# Altium schematic sheet Relay and connector.SchDoc
size A4; SheetNumber: 2; SheetTotal: 3
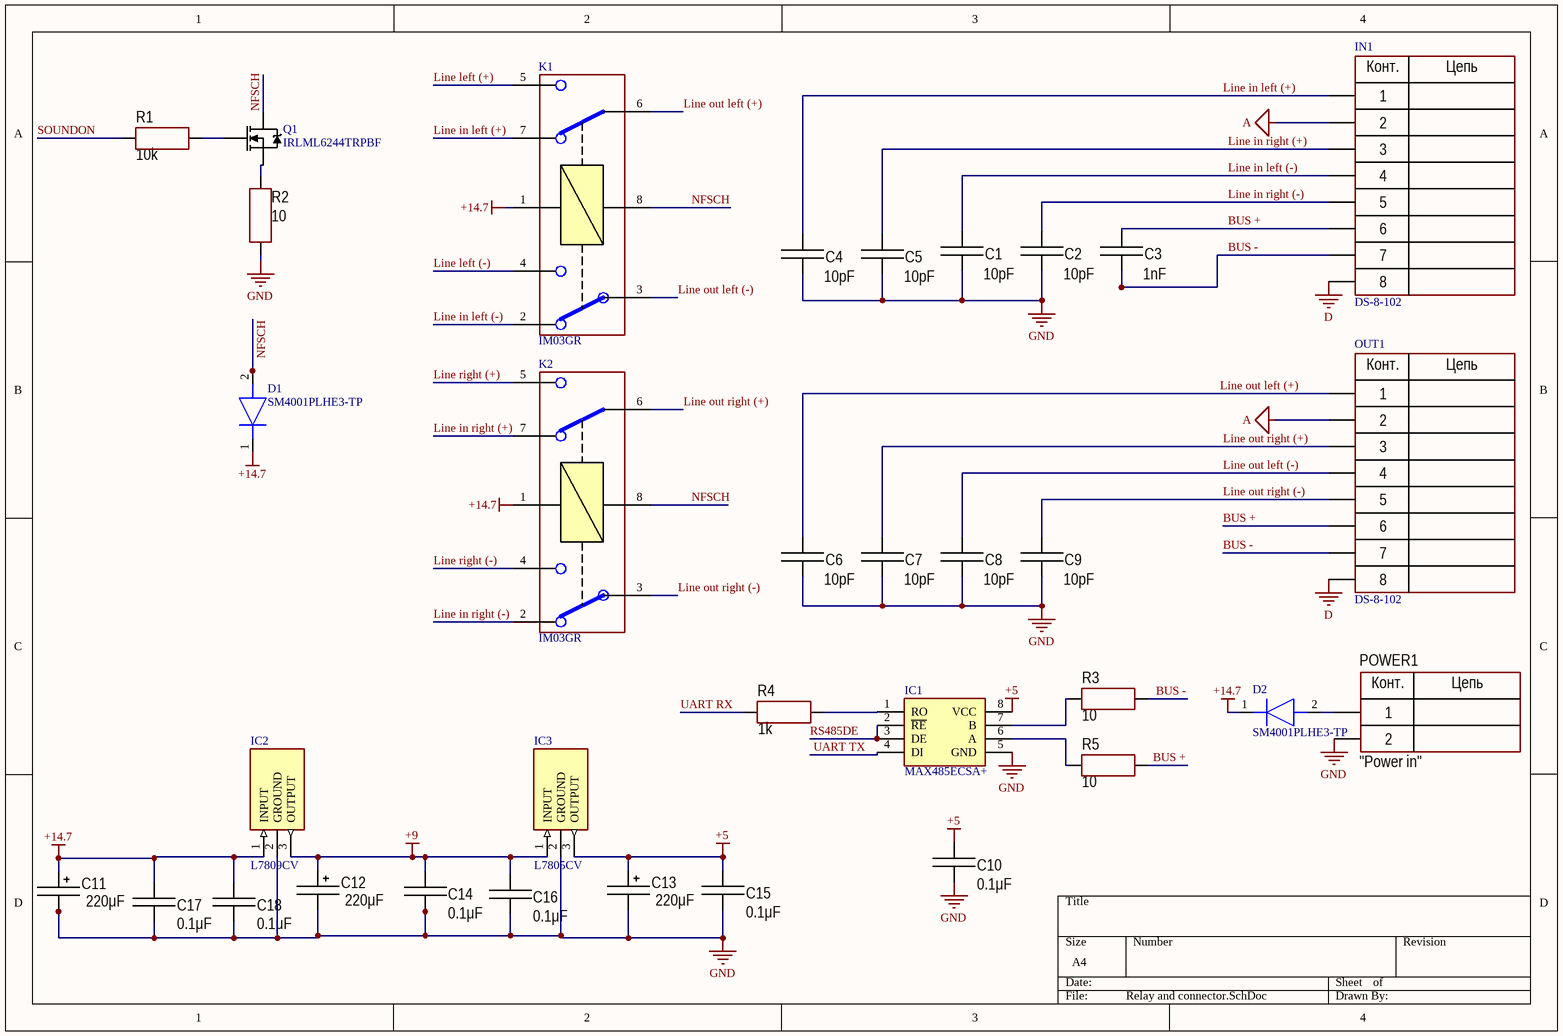
[diagram p0: Relay and connector.SchDoc]

## Parts
C1  value 10pF  [CAP: 0805]
C2  value 10pF  [CAP: 0805]
C3  value 1nF  [CAP: 0805]
C4  value 10pF  [CAP: 0805]
C5  value 10pF  [CAP: 0805]
C6  value 10pF  [CAP: 0805]
C7  value 10pF  [CAP: 0805]
C8  value 10pF  [CAP: 0805]
C9  value 10pF  [CAP: 0805]
C10  value 0.1μF  [CAP: 0805]
C11  value 220μF  [CAP: D10C5H20]
C12  value 220μF  [CAP: D10C5H20]
C13  value 220μF  [CAP: D10C5H20]
C14  value 0.1μF  [CAP: 0805]
C15  value 0.1μF  [CAP: 0805]
C16  value 0.1μF  [CAP: 0805]
C17  value 0.1μF  [CAP: 0805]
C18  value 0.1μF  [CAP: 0805]
D1  SM4001PLHE3-TP  [SODFL3616X135N]
D2  SM4001PLHE3-TP  [SODFL3616X135N]
IC1  MAX485ECSA+  [SOIC127P600X175-8N]
IC2  L7809CV  [TO255P460X1020X2008-3P]
IC3  L7805CV  [TO255P460X1020X2008-3P]
IN1  DS-8-102  [DS-8-102]
K1  IM03GR  [IM06GR]
K2  IM03GR  [IM06GR]
OUT1  DS-8-102  [DS-8-102]
POWER1  CommentText: "Power in"  [CON: CWF-2]
Q1  IRLML6244TRPBF  [SOT95P237X112-3N]
R1  value 10k  [RES: 0805]
R2  value 10  [RES: 0805]
R3  value 10  [RES: 0805]
R4  value 1k  [RES: 0805]
R5  value 10  [RES: 0805]

## Nets
+5: C10.1 C13.1 C15.1 IC1.8(VCC) IC3.3(OUTPUT)
+9: C12.1 C14.1 C16.1 IC2.3(OUTPUT) IC3.1(INPUT)
+14.7: C11.1 C17.1 C18.1 D1.1(K) D2.1(K) IC2.1(INPUT) K1.1 K2.1
A: IN1.2 OUT1.2
D: IN1.8 OUT1.8
GND: C1.1 C2.1 C4.1 C5.1 C6.1 C7.1 C8.1 C9.1 C10.2 C11.2 C12.2 C13.2 C14.2 C15.2 C16.2 C17.2 C18.2 IC1.5(GND) IC2.2(GROUND) IC3.2(GROUND) POWER1.2 R2.1
BUS +: C3.2 IN1.6 OUT1.6 R5.2
BUS -: C3.1 IN1.7 OUT1.7 R3.2
Line in left (+): C4.2 IN1.1 K1.7
Line in left (-): C1.2 IN1.4 K1.2
Line in right (+): C5.2 IN1.3 K2.7
Line in right (-): C2.2 IN1.5 K2.2
Line left (+): K1.5
Line left (-): K1.4
Line out left (+): C6.2 K1.6 OUT1.1
Line out left (-): C8.2 K1.3 OUT1.4
Line out right (+): C7.2 K2.6 OUT1.3
Line out right (-): C9.2 K2.3 OUT1.5
Line right (+): K2.5
Line right (-): K2.4
NFSCH: D1.2(A) K1.8 K2.8 Q1.3(D)
RS485DE: IC1.2(~{RE}) IC1.3(DE)
SOUNDON: R1.1
UART RX: R4.1
UART TX: IC1.4(DI)
NetD2_2: D2.2(A) POWER1.1
NetIC1_1: IC1.1(RO) R4.2
NetIC1_6: IC1.6(A) R5.1
NetIC1_7: IC1.7(B) R3.1
NetQ1_1: Q1.1(G) R1.2
NetQ1_2: Q1.2(S) R2.2

## Notes on the sheet
- (in symbol CWF-2) Конт.; Цепь
- (in symbol DS-8-102) Конт.; Цепь

## Library data of the parts
C1 C2 C4-C9 = Ceramic_0805: Manufacturer: Yageo; PartNumber: CC0805KRX7R7BB104; ValueManufacturerPartNumber: Ceramic capacitor, 10pF, X7R, ±10%, 16V, 0805, -55...+125°C; TypeCapacitor: Ceramic capacitor; Tolerance: ±10%; TypeDielectric: X7R; Voltage: 16V; Package: 0805; HelpURL: https://www.digikey.com/product-detail/en/yageo/CC0805KRX7R7BB104/311-1142-1-ND/303052; Temperature: -55...+125°C
C3 = Ceramic_0805: Manufacturer: Yageo; PartNumber: CC0805KRX7R7BB104; ValueManufacturerPartNumber: Ceramic capacitor, 1nF, X7R, ±10%, 16V, 0805, -55...+125°C; TypeCapacitor: Ceramic capacitor; Tolerance: ±10%; TypeDielectric: X7R; Voltage: 16V; Package: 0805; HelpURL: https://www.digikey.com/product-detail/en/yageo/CC0805KRX7R7BB104/311-1142-1-ND/303052; Temperature: -55...+125°C
C10 C14-C18 = Ceramic_0805: Manufacturer: Yageo; PartNumber: CC0805KRX7R7BB104; TypeCapacitor: Ceramic capacitor; Tolerance: ±10%; TypeDielectric: X7R; Package: 0805; HelpURL: https://www.digikey.com/product-detail/en/yageo/CC0805KRX7R7BB104/311-1142-1-ND/303052; ValueManufacturerPartNumber: =TypeCapacitor+', '+Value+', '+TypeDielectric+', '+Tolerance+', '+Voltage+', '+Package+', '+Temperature; Temperature: -55...+125°C
C11-C13 = Aluminium: Manufacturer: Wurth; PartNumber: 860080475013; ValueManufacturerPartNumber: Aluminium capacitor, 220μF, 25V, ±20%, 54mOhm, 14x10x5 mm, -55...+105°C; TypeCapacitor: Aluminium capacitor; Tolerance: ±20%; Impedance: 54mOhm; Voltage: 25V; Package: 14x10x5 mm; HelpURL: https://www.digikey.com/product-detail/en/wurth-electronics-inc/860080475013/732-9029-1-ND/5728972; Temperature: -55...+105°C
D1 D2 = SM4001PLHE3-TP: Diode; Manufacturer_Name: MCC; Datasheet Link: https://www.mccsemi.com/pdf/Products/SM4001PLHE3-SM4007PLHE3(SOD-123FL).pdf; Height: 1.35mm; Manufacturer_Part_Number: SM4001PLHE3-TP; Mouser Part Number: 833-SM4001PLHE3-TP; Mouser Price/Stock: https://www.mouser.co.uk/ProductDetail/Micro-Commercial-Components-MCC/SM4001PLHE3-TP?qs=QNEnbhJQKvZveZWFAoodWg%3D%3D; Arrow Part Number: SM4001PLHE3-TP; Arrow Price/Stock: https://www.arrow.com/en/products/sm4001plhe3-tp/micro-commercial-components?region=nac
IC1 = MAX485ECSA+: Integrated Circuit; Manufacturer_Name: Analog Devices; Datasheet Link: http://datasheets.maximintegrated.com/en/ds/MAX1487E-MAX491E.pdf; Height: 1.75mm; Manufacturer_Part_Number: MAX485ECSA+; Mouser Part Number: 700-MAX485ECSA; Mouser Price/Stock: https://www.mouser.co.uk/ProductDetail/Analog-Devices-Maxim-Integrated/MAX485ECSA%2b?qs=1THa7WoU59Gy3FCdT5o1Tg%3D%3D; Arrow Part Number: MAX485ECSA+; Arrow Price/Stock: https://www.arrow.com/en/products/max485ecsa/maxim-integrated?region=nac
IC2 = L7809CV: Integrated Circuit; Manufacturer_Name: STMicroelectronics; Datasheet Link: http://www.st.com/web/en/resource/technical/document/datasheet/CD00000444.pdf; Height: 4.6mm; Manufacturer_Part_Number: L7809CV; Mouser Part Number: 511-L7809CV; Mouser Price/Stock: https://www.mouser.co.uk/ProductDetail/STMicroelectronics/L7809CV?qs=sps7W%2FwBcGH358Eg%2FiFhSA%3D%3D; Arrow Part Number: L7809CV; Arrow Price/Stock: https://www.arrow.com/en/products/l7809cv/stmicroelectronics?region=europe
IC3 = L7805CV: Integrated Circuit; Manufacturer_Name: STMicroelectronics; Datasheet Link: http://www.st.com/web/en/resource/technical/document/datasheet/CD00000444.pdf; Height: 4.6mm; Manufacturer_Part_Number: L7805CV; Mouser Part Number: 511-L7805CV; Mouser Price/Stock: https://www.mouser.co.uk/ProductDetail/STMicroelectronics/L7805CV?qs=9NrABl3fj%2FqplZAHiYUxWg%3D%3D; Arrow Part Number: L7805CV; Arrow Price/Stock: https://www.arrow.com/en/products/l7805cv/stmicroelectronics?region=europe
K1 K2 = IM03GR: Relay or Contactor; Manufacturer_Name: TE Connectivity; Datasheet Link: https://datasheet.datasheetarchive.com/originals/distributors/Datasheets_SAMA/af0478e68580ade93768a4593bd7be66.pdf; Manufacturer_Part_Number: IM03GR; Mouser Part Number: 655-IM03GR; Mouser Price/Stock: https://www.mouser.co.uk/ProductDetail/TE-Connectivity/IM03GR?qs=h8jywBNgiq20bLq7q22y%252Bg%3D%3D; Arrow Part Number: IM03GR; Arrow Price/Stock: https://www.arrow.com/en/products/im03gr/te-connectivity?region=nac
POWER1 = CWF-2: Manufacturer: Connfly; ValueManufacturerPartNumber: Connector, 2pin, 2.54mm, 250VAC, 3A; PartNumber: CWF-2R; TypeConnector: Connector; VoltageMax: 250VAC; Pitch: 2.54mm; CurrentMax: 3A; Multichannel: 2pin; HelpURL: https://www.chipdip.ru/product/cwf-2r-ds1069-2-mr
Q1 = IRLML6244TRPBF: Transistor; Manufacturer_Name: Infineon; Datasheet Link: http://www.infineon.com/dgdl/irlml6244pbf.pdf?fileId=5546d462533600a4015356686fed261f; Height: 1.12mm; Manufacturer_Part_Number: IRLML6244TRPBF; Mouser Part Number: 942-IRLML6244TRPBF; Mouser Price/Stock: https://www.mouser.co.uk/ProductDetail/Infineon-Technologies/IRLML6244TRPBF?qs=9%252BKlkBgLFf1HkY%2F2U%252BIhLQ%3D%3D; Arrow Part Number: IRLML6244TRPBF; Arrow Price/Stock: https://www.arrow.com/en/products/irlml6244trpbf/infineon-technologies-ag?region=europe
R1 = Resistor_0805: Manufacturer: Yageo; PartNumber: RC0805JR-07100RL; ValueManufacturerPartNumber: Resistor film, 10k, ±5%, 0805, 0.125W, -55...+125°C; TypeResistor: Resistor film; Power: 0.125W; Tolerance: ±5%; Package: 0805; HelpURL: https://www.digikey.com/product-detail/en/yageo/RC0805JR-07100RL/311-100ARCT-ND/731185; Temperature: -55...+125°C
R2 R3 R5 = Resistor_0805: Manufacturer: Yageo; PartNumber: RC0805JR-07100RL; ValueManufacturerPartNumber: Resistor film, 10, ±5%, 0805, 0.125W, -55...+125°C; TypeResistor: Resistor film; Power: 0.125W; Tolerance: ±5%; Package: 0805; HelpURL: https://www.digikey.com/product-detail/en/yageo/RC0805JR-07100RL/311-100ARCT-ND/731185; Temperature: -55...+125°C
R4 = Resistor_0805: Manufacturer: Yageo; PartNumber: RC0805JR-07100RL; ValueManufacturerPartNumber: Resistor film, 1k, ±5%, 0805, 0.125W, -55...+125°C; TypeResistor: Resistor film; Power: 0.125W; Tolerance: ±5%; Package: 0805; HelpURL: https://www.digikey.com/product-detail/en/yageo/RC0805JR-07100RL/311-100ARCT-ND/731185; Temperature: -55...+125°C